# Altium project OpenRing_Debug.PrjPcb
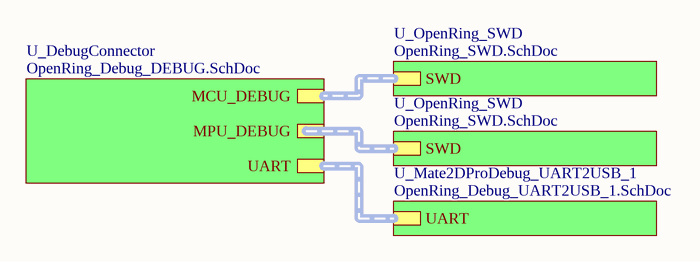
[diagram p0: OpenRing_Debug_Main.SchDoc]
4 sheets, 25 parts. Net scope: hierarchical (ports join the sheet entries above them; power ports are global).
Board file: OpenRing_Debug.PcbDoc
Sheets:
  OpenRing_Debug_Main.SchDoc
    U_DebugConnector = OpenRing_Debug_DEBUG.SchDoc
    U_Mate2DProDebug_UART2USB_1 = OpenRing_Debug_UART2USB_1.SchDoc
    U_OpenRing_SWD = OpenRing_SWD.SchDoc
    U_OpenRing_SWD = OpenRing_SWD.SchDoc

## Sheet OpenRing_Debug_Main.SchDoc
size A4; SheetNumber: 1; SheetTotal: 4; Size: A4

### Sub-sheets
U_DebugConnector = OpenRing_Debug_DEBUG.SchDoc: MCU_DEBUG (harness MCU_DEBUG), MPU_DEBUG (harness MPU_DEBUG), UART (harness UART)
U_Mate2DProDebug_UART2USB_1 = OpenRing_Debug_UART2USB_1.SchDoc: UART (harness UART)
U_OpenRing_SWD = OpenRing_SWD.SchDoc: SWD (harness SWD)
U_OpenRing_SWD = OpenRing_SWD.SchDoc: SWD (harness SWD)

### Buses and harness runs
harness sheet U_DebugConnector/MCU_DEBUG = sheet U_OpenRing_SWD/SWD
harness sheet U_DebugConnector/MPU_DEBUG = sheet U_OpenRing_SWD/SWD
harness sheet U_DebugConnector/UART = sheet U_Mate2DProDebug_UART2USB_1/UART

### Notes on the sheet
- Designer/Engineer
- Drawn By
- Document Name
- Board Title
- Sheet
- of
- Size
- Approved By
- Rev.
- Date

## Sheet OpenRing_Debug_DEBUG.SchDoc
size A4; SheetNumber: 2; SheetTotal: 4
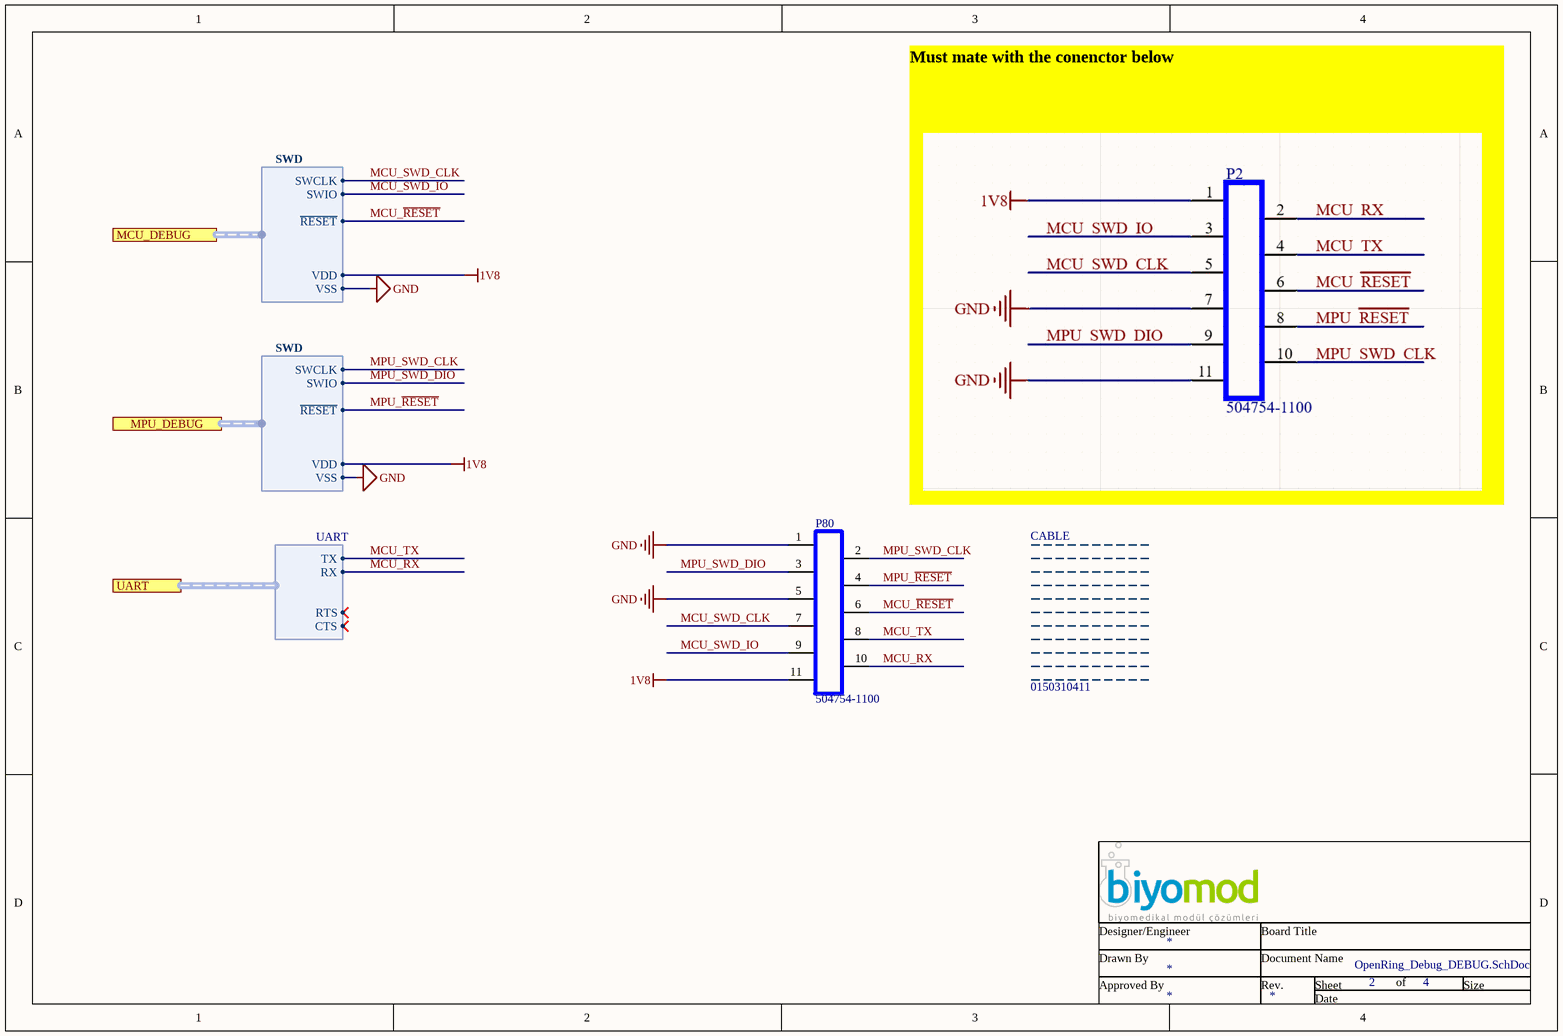
[diagram p1: OpenRing_Debug_DEBUG.SchDoc]

### Parts
CABLE  0150310411
P80  504754-1100  [5047541100]

### Ports
MCU_DEBUG (harness SWD), MPU_DEBUG (harness SWD), UART (harness UART)

### Harnesses
UART: TX, RX, RTS, CTS
SWD: SWCLK, SWIO, ~{RESET}, VDD, VSS

### Nets
1V8: P80.11 ; port MCU_DEBUG.VDD, port MPU_DEBUG.VDD
GND: P80.1 P80.5 ; port MCU_DEBUG.VSS, port MPU_DEBUG.VSS
MCU_~{RESET}: P80.6 ; port MCU_DEBUG.~{RESET}
MCU_RX: P80.10 ; port UART.RX
MCU_SWD_CLK: P80.7 ; port MCU_DEBUG.SWCLK
MCU_SWD_IO: P80.9 ; port MCU_DEBUG.SWIO
MCU_TX: P80.8 ; port UART.TX
MPU_~{RESET}: P80.4 ; port MPU_DEBUG.~{RESET}
MPU_SWD_CLK: P80.2 ; port MPU_DEBUG.SWCLK
MPU_SWD_DIO: P80.3 ; port MPU_DEBUG.SWIO

### Notes on the sheet
- Must mate with the conenctor below
- Designer/Engineer
- Drawn By
- Document Name
- Board Title
- Sheet
- of
- Size
- Approved By
- Rev.
- Date

### Library data of the parts
CABLE = 0150310411: 0.30mm Pitch Premo-Flex FPC Jumper with Notches, Same Side Contacts (Type A), 102.00mm Cable Length, Gold (Au) Plating, 11 Circuits; Manufacturer: Molex; Supplier: Mouser; Supplier Part Number: 538-15031-0411; Manufacturer Part Number: 0150310411; RoHS: No; Stock: 373; Pricing: 1=2.72, 10=2.23, 50=1.99, 100=1.89, 1000=1.69, 10000=1.69 (USD); Supplier 1: Mouser; Supplier Part Number 1: 538-15031-0411; Supplier 2: Farnell; Supplier Part Number 2: 4043858
P80 = 504754-1100: Conn FFC/FPC Connector SKT 11 POS 0.3mm Solder RA SMD Easy-On™ T/R; Manufacturer: Molex; CHECKED: FALSE; Supplier: Mouser; Supplier Part Number: 538-504754-1100; Manufacturer Part Number: 504754-1100; RoHS: No; Stock: 6459; Pricing: 1=0.77, 10=0.628, 50=0.544, 100=0.512, 1000=0.426, 10000=0.355 (USD); ComponentLink1URL: https://datasheet.octopart.com/504754-1100-Molex-datasheet-169278456.pdf?src-supplier=Farnell; ComponentLink1Description: https://datasheet.octopart.com/504754-1100-Molex-datasheet-169278456.pdf?src-supplier=Farnell; ComponentLink2URL: http://datasheet.octopart.com/5047541100-Molex-datasheet-38188796.pdf?src-supplier=Onlinecomponents.com; ComponentLink2Description: http://datasheet.octopart.com/5047541100-Molex-datasheet-38188796.pdf?src-supplier=Onlinecomponents.com; ComponentLink3URL: http://datasheet.octopart.com/5047541100-Molex-datasheet-38188796.pdf?src-supplier=Verical; ComponentLink3Description: http://datasheet.octopart.com/5047541100-Molex-datasheet-38188796.pdf?src-supplier=Verical; ComponentLink4URL: http://datasheet.octopart.com/5047541100-Molex-datasheet-38188796.pdf?src-supplier=Avnet; ComponentLink4Description: http://datasheet.octopart.com/5047541100-Molex-datasheet-38188796.pdf?src-supplier=Avnet; ComponentLink5URL: http://datasheet.octopart.com/5047541100-Molex-datasheet-38188796.pdf?src-supplier=TTI; ComponentLink5Description: http://datasheet.octopart.com/5047541100-Molex-datasheet-38188796.pdf?src-supplier=TTI; ComponentLink6URL: http://datasheet.octopart.com/5047541100-Molex-datasheet-38188796.pdf?src-supplier=Electro+Sonic; ComponentLink6Description: http://datasheet.octopart.com/5047541100-Molex-datasheet-38188796.pdf?src-supplier=Electro+Sonic; ComponentLink7URL: https://datasheet.octopart.com/504754-1100-Molex-datasheet-154754160.pdf?src-supplier=Master+Electronics; ComponentLink7Description: https://datasheet.octopart.com/504754-1100-Molex-datasheet-154754160.pdf?src-supplier=Master+Electronics; Supplier 1: Mouser; Supplier Part Number 1: 538-504754-1100; System: Connector

## Sheet OpenRing_Debug_UART2USB_1.SchDoc
size A4; SheetNumber: 4; SheetTotal: 4
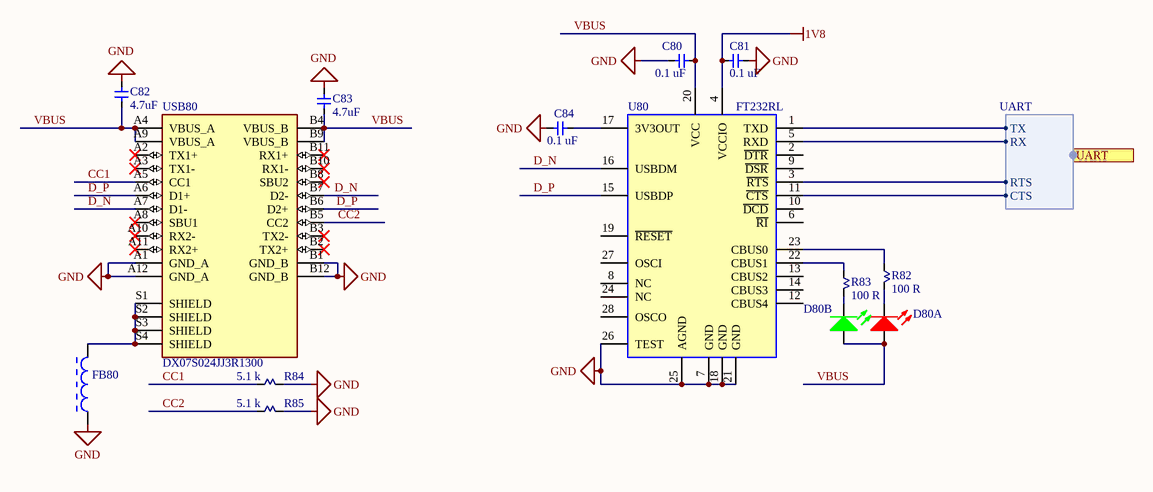
[diagram p2: OpenRing_Debug_UART2USB_1.SchDoc]

### Parts
C80  0.1 uF  [CAPC1005X05N]
C81  0.1 uF  [CAPC1005X05N]
C82  4.7uF  [CAPC1610X05N]
C83  4.7uF  [CAPC1610X05N]
C84  0.1 uF  [CAPC1005X05N]
D80  LTST-C155KGJRKT  [LTST-C155KGJRKT]  (value not drawn)  (parts A,B of 2)
FB80  BLM15AG601SN1D  [MURA-BLM15-CHIP-2_V]  (value not drawn)
R82  100 R  [RESC1005X04N]
R83  100 R  [RESC1005X04N]
R84  5.1 k  [RESC1005X04N]
R85  5.1 k  [RESC1005X04N]
U80  FT232RL  [SOP65P780X200-28N]
USB80  DX07S024JJ3R1300  [JAE-DX07S024JJ3R1300-MFG]

### Ports
UART (harness UART)

### Harnesses
UART: TX, RX, RTS, CTS

### Nets
1V8: C81.2 U80.4(VCCIO)
GND: C80.2 C81.1 C82.1 C83.1 C84.2 FB80.1 R84.2 R85.2 U80.7(GND) U80.18(GND) U80.21(GND) U80.25(AGND) U80.26(TEST) USB80.A1(GND_A) USB80.A12(GND_A) USB80.B1(GND_B) USB80.B12(GND_B)
CC1: R84.1 USB80.A5(CC1)  [project net CC1_4]
CC2: R85.1 USB80.B5(CC2)  [project net CC2_4]
D_N: U80.16(USBDM) USB80.A7(D1-) USB80.B7(D2-)  [project net D_N_4]
D_P: U80.15(USBDP) USB80.A6(D1+) USB80.B6(D2+)  [project net D_P_4]
MCU_RX: U80.5(RXD) ; port UART.RX
MCU_TX: U80.1(TXD) ; port UART.TX
VBUS: C80.1 C82.2 C83.2 D80.1(A) D80.2(A) U80.20(VCC) USB80.A4(VBUS_A) USB80.A9(VBUS_A) USB80.B4(VBUS_B) USB80.B9(VBUS_B)  [project net VBUS_4]
NetC84_1: C84.1 U80.17(3V3OUT)
NetD80_3: D80.3(K) R83.1
NetD80_4: D80.4(K) R82.1
NetFB80_2: FB80.2 USB80.S1(SHIELD) USB80.S2(SHIELD) USB80.S3(SHIELD) USB80.S4(SHIELD)
NetR82_2: R82.2 U80.23(CBUS0)
NetR83_2: R83.2 U80.22(CBUS1)
NetU80_3: U80.3(~{RTS}) ; port UART.RTS
NetU80_11: U80.11(~{CTS}) ; port UART.CTS

Not connected (* = marked no-connect by the designer): U80 2(~{DTR}) 6(~{RI}) 8(NC) 9(~{DSR}) 10(~{DCD}) 12(CBUS4) 13(CBUS2) 14(CBUS3) 19(~{RESET}) 24(NC) 27(OSCI) 28(OSCO); USB80 A2(TX1+)* A3(TX1-)* A8(SBU1)* A10(RX2-)* A11(RX2+)* B2(TX2+)* B3(TX2-)* B8(SBU2)* B10(RX1-)* B11(RX1+)*

### Notes on the sheet
- Designer/Engineer
- Drawn By
- Document Name
- Board Title
- Sheet
- of
- Size
- Approved By
- Rev.
- Date

### Library data of the parts
C80 C81 C84 = GRM155R61C104KA88D: CAP CER 0.1UF 16V X5R 0402; Manufacturer: Murata Electronics; Tolerance: 10 %; Type: Chip Multilayer Ceramic Capacitor for General Purpose; Voltage Rating DC: 16 VDC; Capacitance - nF: 100 nF; Capacitance - pF: 100000 pF; Supplier 1: Mouser; Manufacturer Part Number: GRM155R61C104KA88D; RoHS: RoHS Compliant; Category: Multilayer Ceramic Capacitors MLCC - SMD/SMT; Packaging: Cut Tape; Capacitance: 0.1 uF; Package / Case: 0402 (1005 metric); ComponentLink1URL: http://www.mouser.com/datasheet/2/281/murata_03052018_GRM_Series_1-1310166.pdf; ComponentLink1Description: http://www.mouser.com/datasheet/2/281/murata_03052018_GRM_Series_1-1310166.pdf; Supplier Part Number 1: 81-GRM155R61C104KA8D; Value: 0.1 uF; Stock: 0; Pricing: 1=0.082, 10=0.026, 100=0.011, 500=0.008, 1000=0.007, 2500=0.006, 5000=0.005, 10000=0.004 (EUR); Height: 0.5 mm; Length: 1 mm; Product: General Type MLCCs; Series: GRM; Termination Style: SMD/SMT; Width: 0.5 mm; Brand: Murata Electronics; Case Code - in: 0402; Case Code - mm: 1005; Dielectric: X5R; Maximum Operating Temperature: + 85 C; Minimum Operating Temperature: - 55 C; Standard Pack Qty: 10000; Termination: Standard; RoHS - Mouser: Y; Minimum Order Quantity: 1; Reeling: True; Supplier 2: Digikey; Supplier Part Number 2: 490-5415-1-ND; Supplier 3: Digikey; Supplier Part Number 3: 490-5415-6-ND
C82 C83 = CL10A475KP8NNNC: Cap Ceramic 4.7uF 10V X5R 10% Pad SMD 0603 85C T/R; Manufacturer: Samsung; Supplier 1: Digi-Key; Supplier Part Number 1: 1276-1044-1-ND; Manufacturer Part Number: CL10A475KP8NNNC; RoHS: Yes; Category: Ceramic Capacitors; Stock 1: 1008646; Pricing 1: 1=0.10000, 10=0.04800, 50=0.02620, 100=0.02140, 500=0.01528, 1000=0.01201 (USD); Mount: Surface Mount; Case/Package: 0603; Case Code (Imperial): 0603; Contact Plating: Tin; Case Code (Metric): 1608; Min Operating Temperature: -55°C; Max Operating Temperature: 85°C; Tolerance: 10%; Capacitance: 4.7uF; Dielectric: X5R; Package Quantity: 1; Packaging: Tape and Reel; Voltage Rating: 10V; Length: 1.6mm; Width: 0.031inch; Height: 0.8mm; Thickness: 0.035inch; Depth: 0.8mm; Radiation Hardening: No; ComponentLink1URL: https://datasheet.ciiva.com/25797/cl10a475kp8nnnc-25797520.pdf?src-supplier=Digi-Key; ComponentLink1Description: https://datasheet.ciiva.com/25797/cl10a475kp8nnnc-25797520.pdf?src-supplier=Digi-Key; ComponentLink2URL: https://datasheet.ciiva.com/26838/getdatasheetpartid-358676-26838384.pdf?src-supplier=Verical; ComponentLink2Description: https://datasheet.ciiva.com/26838/getdatasheetpartid-358676-26838384.pdf?src-supplier=Verical; ComponentLink3URL: https://datasheet.ciiva.com/16318/cl05b104kq5nnnc-16318245.pdf?src-supplier=Future+Electronics; ComponentLink3Description: https://datasheet.ciiva.com/16318/cl05b104kq5nnnc-16318245.pdf?src-supplier=Future+Electronics
D80 = LTST-C155KGJRKT: LED GREEN/RED CLEAR CHIP SMD; Manufacturer: Vishay Lite-On; Color: Green,Red; Lens Color: Colorless; Viewing Angle: 130°; Reverse Voltage: 5V; Wavelength: 639nm; Number of LEDs: 2; Forward Current: 30mA; Forward Voltage: 2V; Power Rating: 75mW; Luminous Intensity: 45mcd; Lens Style: Diffused,Colorless,Rectangular,Clear; Dominant Wavelength: 631nm; Test Current: 20mA; Supplier 1: Digi-Key; Manufacturer Part Number: LTST-C155KGJRKT; RoHS: Yes; Category: LEDs; Stock 1: 123598; Pricing 1: 1=0.43000, 10=0.28000, 100=0.18670, 500=0.12912, 1000=0.10760 (USD); Packaging: Tape and Reel; Lens Transparency: Clear; ComponentLink1URL: https://datasheet.ciiva.com/11774/0900766b80dc0273-11774195.pdf?src-supplier=RSComponents; ComponentLink1Description: https://datasheet.ciiva.com/11774/0900766b80dc0273-11774195.pdf?src-supplier=RSComponents; Supplier Part Number 1: 160-1409-1-ND; Mount: Surface Mount; Case/Package: 1210; Number of Pins: 4; Case Code (Imperial): 1210; Case Code (Metric): 3225; Min Operating Temperature: -55°C; Max Operating Temperature: 85°C; Package Quantity: 1; Illumination Color: Green,Red; Number of Elements: 2; Power Dissipation: 75mW; Max Power Dissipation: 75mW; Length: 2.7mm; Width: 2.7mm; Height: 1.1mm; Depth: 3.2mm; Radiation Hardening: No; Lead Free: Lead Free; ComponentLink2URL: https://datasheet.ciiva.com/15117/getdatasheetpartid-103641-15117440.pdf?src-supplier=Verical; ComponentLink2Description: https://datasheet.ciiva.com/15117/getdatasheetpartid-103641-15117440.pdf?src-supplier=Verical; ComponentLink3URL: https://datasheet.ciiva.com/16366/lite-on20ltst-c155kgjrkt-16366147.pdf?src-supplier=Future+Electronics; ComponentLink3Description: https://datasheet.ciiva.com/16366/lite-on20ltst-c155kgjrkt-16366147.pdf?src-supplier=Future+Electronics; ComponentLink4URL: https://datasheet.ciiva.com/27051/1260277-27051786.pdf?src-supplier=Jameco; ComponentLink4Description: https://datasheet.ciiva.com/27051/1260277-27051786.pdf?src-supplier=Jameco; ComponentLink5URL: https://datasheet.ciiva.com/2110/s-110-ltst-c155kgjrkt-2110800.pdf?src-supplier=Digi-Key; ComponentLink5Description: https://datasheet.ciiva.com/2110/s-110-ltst-c155kgjrkt-2110800.pdf?src-supplier=Digi-Key; ComponentLink6URL: https://datasheet.ciiva.com/2110/s-110-ltst-c155kgjrkt-2110801.pdf?src-supplier=Digi-Key; ComponentLink6Description: https://datasheet.ciiva.com/2110/s-110-ltst-c155kgjrkt-2110801.pdf?src-supplier=Digi-Key
FB80 = BLM15AG601SN1D: FERRITE BEAD 600 OHM 0402 1LN; Manufacturer: Murata; Material: Steel,Ferrite; Max DC Current: 300mA; DC Resistance (DCR): 520mR; Impedance: 600R; Test Frequency: 100MHz; Number of Lines: 1; Tolerance: 25%; Shielding: Unshielded; Supplier 1: Digi-Key; Supplier Part Number 1: 490-1006-1-ND; Manufacturer Part Number: BLM15AG601SN1D; RoHS: Yes; Category: Inductors; Stock 1: 436370; Pricing 1: 1=0.10000, 10=0.07600, 25=0.06960, 50=0.06260, 100=0.04590, 250=0.03336, 500=0.03058, 1000=0.02641, 5000=0.02085 (USD); Case/Package: 0402; Number of Pins: 2; Case Code (Metric): 1005; Case Code (Imperial): 0402; Core Material: Ferrite; Min Operating Temperature: -55°C; Max Operating Temperature: 125°C; Package Quantity: 10000; Packaging: Tape and Reel; Current Rating: 300mA; Termination: SMD/SMT; Max Current Rating: 300mA; Number of Circuits: 1; DC Current: 300mA; Frequency: 100MHz; Length: 1mm; Width: 0.5mm; Height: 0.5mm; Depth: 0.55mm; Radiation Hardening: No; REACH SVHC: No SVHC; Lead Free: Lead Free; Military Standard: Not; ComponentLink1URL: https://datasheet.ciiva.com/11799/0900766b811b5866-11799226.pdf?src-supplier=RSComponents; ComponentLink1Description: https://datasheet.ciiva.com/11799/0900766b811b5866-11799226.pdf?src-supplier=RSComponents; ComponentLink2URL: https://datasheet.ciiva.com/29347/442210-da-01-en-chip-drossel-0402-600r-300ma-1-0x0-5mm-29347879.pdf?src-supplier=Conrad; ComponentLink2Description: https://datasheet.ciiva.com/29347/442210-da-01-en-chip-drossel-0402-600r-300ma-1-0x0-5mm-29347879.pdf?src-supplier=Conrad; ComponentLink3URL: https://datasheet.ciiva.com/41449/001172163-da-01-en-drossel-0402-600r-1-0x0-5mm-10000st-41449450.pdf?src-supplier=Conrad; ComponentLink3Description: https://datasheet.ciiva.com/41449/001172163-da-01-en-drossel-0402-600r-1-0x0-5mm-10000st-41449450.pdf?src-supplier=Conrad; ComponentLink4URL: https://datasheet.ciiva.com/6212/l0110s0100blm15ag-sn-6212565.pdf?src-supplier=Digi-Key; ComponentLink4Description: https://datasheet.ciiva.com/6212/l0110s0100blm15ag-sn-6212565.pdf?src-supplier=Digi-Key; ComponentLink5URL: https://datasheet.ciiva.com/6212/l0110s0100blm15ag-sn-6212519.pdf?src-supplier=Digi-Key; ComponentLink5Description: https://datasheet.ciiva.com/6212/l0110s0100blm15ag-sn-6212519.pdf?src-supplier=Digi-Key; ComponentLink6URL: https://datasheet.ciiva.com/1466/5144-1466744.pdf?src-supplier=Element14; ComponentLink6Description: https://datasheet.ciiva.com/1466/5144-1466744.pdf?src-supplier=Element14; ComponentLink7URL: https://datasheet.ciiva.com/6212/l0110s0100blm15ag-sn-6212520.pdf?src-supplier=Digi-Key; ComponentLink7Description: https://datasheet.ciiva.com/6212/l0110s0100blm15ag-sn-6212520.pdf?src-supplier=Digi-Key; ComponentLink8URL: https://datasheet.ciiva.com/1466/5144-1466745.pdf?src-supplier=Element14; ComponentLink8Description: https://datasheet.ciiva.com/1466/5144-1466745.pdf?src-supplier=Element14; ComponentLink9URL: https://datasheet.ciiva.com/8510/l0110s0100blm15ag-sn-8510909.pdf?src-supplier=Avnet; ComponentLink9Description: https://datasheet.ciiva.com/8510/l0110s0100blm15ag-sn-8510909.pdf?src-supplier=Avnet; ComponentLink10URL: https://datasheet.ciiva.com/14122/blm-series-eng-tds-14122894.pdf?src-supplier=Distrelec; ComponentLink10Description: https://datasheet.ciiva.com/14122/blm-series-eng-tds-14122894.pdf?src-supplier=Distrelec; ComponentLink11URL: https://datasheet.ciiva.com/8084/l0110s0100blm15ag-sn-8084271.pdf?src-supplier=Avnet; ComponentLink11Description: https://datasheet.ciiva.com/8084/l0110s0100blm15ag-sn-8084271.pdf?src-supplier=Avnet
R82 R83 = ERJ-2RKF1000X: RES SMD 100 OHM 1% 1/10W 0402; Manufacturer: Panasonic Electronic Components; Resistance (Ohms): 100; Power (Watts): 0.1W, 1/10W; Temperature Coefficient: ±100ppm/°C; Supplier 1: Digi-Key; Manufacturer Part Number: ERJ-2RKF1000X; RoHS: RoHS Compliant; Category: Resistors; Stock 1: 1714577; Pricing 1: 1=0.1, 10=0.025, 25=0.018, 50=0.0136, 100=0.01, 250=0.00764, 500=0.00612, 1000=0.00451, 5000=0.00323 (USD); Packaging: Digi-Reel®; Part Status: Active; Tolerance: ±1%; Composition: Thick Film; Features: Automotive AEC-Q200; Operating Temperature: -55°C ~ 155°C; Package / Case: 0402 (1005 Metric); Supplier Device Package: 0402; Size / Dimension: 0.039" L x 0.020" W (1.00mm x 0.50mm); Height - Seated (Max): 0.016" (0.40mm); Number of Terminations: 2; Failure Rate: -; ComponentLink1URL: https://industrial.panasonic.com/cdbs/www-data/pdf/RDA0000/AOA0000C283.pdf; ComponentLink1Description: https://industrial.panasonic.com/cdbs/www-data/pdf/RDA0000/AOA0000C283.pdf; Supplier Part Number 1: P100LDKR-ND; Value: 100 R
R84 R85 = ERJ-2RKF5101X: RES SMD 5.1K OHM 1% 1/10W 0402; Manufacturer: Panasonic; Power Rating: 100mW; Voltage Rating: 50V; Temperature Coefficient: 100ppm/°C; Supplier: Mouser; Supplier Part Number: 667-ERJ-2RKF5101X; Manufacturer Part Number: ERJ-2RKF5101X; RoHS: Yes; Category: Chip SMD Resistors; Stock: 709989; Pricing: 1=0.1, 10=0.016, 50=0.016, 100=0.009, 1000=0.007, 10000=0.004 (USD); Mounting Technology: Surface Mount; Case/Package: 0402; Case Code (Imperial): 0402; Case Code (Metric): 1005; Weight: 2.8E-05oz; Contact Plating: Tin; Min Operating Temperature: -55°C; Max Operating Temperature: 155°C; Value: 5.1 k; Tolerance: 1%; Packaging: Tape and Reel; Package Quantity: 10000; Resistor Type: Thick Film; Termination: SMD/SMT; Number of Terminations: 2; Max Power Dissipation: 100mW; Series: ERJ; Resistance Tolerance: 1%; Technology: THICK FILM; Construction: Rectangular; Voltage Rating (DC): 50V; Length: 1mm; Width: 0.5mm; Height: 0.35mm; Depth: 0.5mm; Reach SVHC Compliant: No; Military Standard: Not; RoHS Compliant: Yes; Lead Free: 5697LeadFree; ComponentLink1URL: https://datasheet.ciiva.com/11821/0900766b80f80784-11821351.pdf?src-supplier=Rs; ComponentLink1Description: https://datasheet.ciiva.com/11821/0900766b80f80784-11821351.pdf?src-supplier=Rs; ComponentLink2URL: https://datasheet.ciiva.com/43467/1678782-43467375.pdf?src-supplier=Farnell; ComponentLink2Description: https://datasheet.ciiva.com/43467/1678782-43467375.pdf?src-supplier=Farnell; ComponentLink3URL: https://datasheet.ciiva.com/16761/70260748-16761739.pdf?src-supplier=Allied+Electronics; ComponentLink3Description: https://datasheet.ciiva.com/16761/70260748-16761739.pdf?src-supplier=Allied+Electronics; ComponentLink4URL: https://datasheet.ciiva.com/16788/70260748-16788554.pdf?src-supplier=Allied+Electronics; ComponentLink4Description: https://datasheet.ciiva.com/16788/70260748-16788554.pdf?src-supplier=Allied+Electronics; ComponentLink5URL: https://datasheet.ciiva.com/9195/aoa0000ce2-9195580.pdf?src-supplier=Avnet; ComponentLink5Description: https://datasheet.ciiva.com/9195/aoa0000ce2-9195580.pdf?src-supplier=Avnet; Supplier 1: Mouser; Supplier Part Number 1: 667-ERJ-2RKF5101X
U80 = FT232RL: IC USB FS SERIAL UART 28-SSOP; Manufacturer Part Number: FT232RL-REEL; Manufacturer: FTDI, Future Technology Devices International Ltd; Number of Channels: 1, UART; FIFO's: 256 Byte; Protocol: RS-232, RS-422, RS-485; Voltage - Supply: 3.3 V ~ 5.25 V; With Auto Flow Control: Yes; RoHS: RoHS Compliant; Category: Integrated Circuits (ICs); Stock 1: 34727; Pricing 1: 1=3.54, 10=3.185, 50=3.028, 100=2.8707, 250=2.55612, 500=2.24152 (EUR); Features: USB to UART; With Parallel Port: -; With IrDA Encoder/Decoder: -; With False Start Bit Detection: -; With Modem Control: Yes; With CMOS: Yes; Mounting Type: Surface Mount; Package / Case: 28-SSOP (0.209", 5.30mm Width); Supplier Device Package: 28-SSOP; Packaging: Digi-Reel®; ComponentLink1URL: http://www.ftdichip.com/Support/Documents/DataSheets/ICs/DS_FT232R.pdf; ComponentLink1Description: http://www.ftdichip.com/Support/Documents/DataSheets/ICs/DS_FT232R.pdf; Supplier 1: Digikey; Supplier Part Number 1: 768-1007-6-ND; Supplier 2: Farnell; Supplier Part Number 2: 1146032RL
USB80 = DX07S024JJ3R1300: Cut Tape - Usb Type C Receptacle Mid Mnt Dual R; Manufacturer: JAE Electronics; Number of Contacts: 24; Number of Ports: 1; Voltage Rating: 20V; Mating Cycles: 10000; Shielding: Shielded; Current Rating: 5A; Manufacturer Part Number: DX07S024JJ3R1300; RoHS: Yes; Category: USB Connectors; Stock: 21875; Pricing: 1=1.78, 10=1.612, 25=1.5272, 50=1.4916, 100=1.4205, 250=1.25048 (USD); Mounting Technology: Surface Mount,Through Hole,Horizontal; Contact Plating: Gold; Insulation Color: Black; Contact Material: 153,157ConductorMaterial; Min Operating Temperature: -30°C; Max Operating Temperature: 80°C; Packaging: Cut Tape; Connector Type: USB; Gender: Receptacle; Series: DX07; Termination: Solder; Height: 3.29mm; RoHS Compliant: Yes; ComponentLink1URL: http://www.alliedelec.com/m/d/e03b7b5d71e2d3e369c52d5c8eaca2b6.pdf?src-supplier=Allied+Electronics; ComponentLink1Description: http://www.alliedelec.com/m/d/e03b7b5d71e2d3e369c52d5c8eaca2b6.pdf?src-supplier=Allied+Electronics; ComponentLink2URL: http://www.jae.com/z-en/pdf_download_exec.cfm?param=SJ115995.pdf&src-supplier=Digikey; ComponentLink2Description: http://www.jae.com/z-en/pdf_download_exec.cfm?param=SJ115995.pdf&src-supplier=Digikey; Supplier 1: Mouser; Supplier Part Number 1: 656-DX07S024JJ3R1300; Supplier 2: Digikey; Supplier Part Number 2: 670-2846-1-ND

## Sheet OpenRing_SWD.SchDoc
size A4; SheetNumber: 3; SheetTotal: 4
Used 2 times, as channels U_OpenRing_SWD, U_OpenRing_SWD. Parts and nets are listed once, with the designators drawn on the sheet.
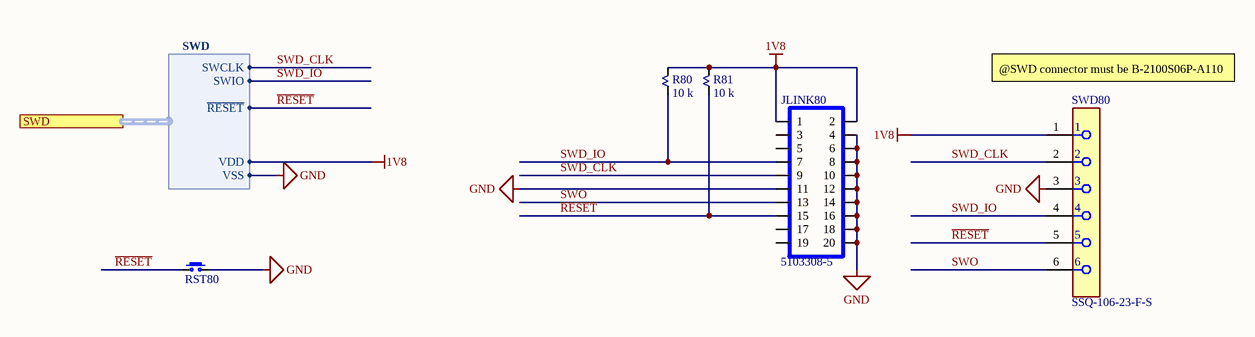
[diagram p3: OpenRing_SWD.SchDoc]

### Parts
JLINK80  5103308-5  [TE_5103308-5]
R80  10 k  [RESC1005X04N]
R81  10 k  [RESC1005X04N]
RST80  B3U-1000P  [B3U-1000P]  (value not drawn)
SWD80  SSQ-106-23-F-S  [FP-SSQ-106-23-F-S-MFG]

### Ports
SWD (harness SWD)

### Harnesses
SWD: SWCLK, SWIO, ~{RESET}, VDD, VSS

### Nets
1V8: JLINK80.1 JLINK80.2 R80.2 R81.2 SWD80.1 ; port SWD.VDD
GND: JLINK80.4 JLINK80.6 JLINK80.8 JLINK80.10 JLINK80.11 JLINK80.12 JLINK80.14 JLINK80.16 JLINK80.18 JLINK80.20 RST80.2 SWD80.3 ; port SWD.VSS
~{RESET}: JLINK80.15 R81.1 RST80.1 SWD80.5 ; port SWD.~{RESET}
SWD_CLK: JLINK80.9 SWD80.2 ; port SWD.SWCLK
SWD_IO: JLINK80.7 R80.1 SWD80.4 ; port SWD.SWIO
SWO: JLINK80.13 SWD80.6  [project net SWO_3]

Not connected (* = marked no-connect by the designer): JLINK80 3 5 17 19

### Channels
U_OpenRing_SWD: designators end in A
U_OpenRing_SWD: designators end in B

### Notes on the sheet
- @SWD connector must be B-2100S06P-A110 to be purchased from JLCPCB
- Designer/Engineer
- Drawn By
- Document Name
- Board Title
- Sheet
- of
- Size
- Approved By
- Rev.
- Date

### Library data of the parts
JLINK80 = 5103308-5: Header; Pin; Vertical; Copper Alloy; Thermoplastic; 20; 0.100 x 0.100 in.; 1 A; Manufacturer: AMP - TE CONNECTIVITY; Supplier 1: Digi-Key; Manufacturer Part Number: 5103308-5; RoHS: No; Category: Headers and Wire Housings; Stock 1: 6694; Pricing 1: 1=2.15000, 10=1.94800, 100=1.66990, 500=1.39158, 1000=1.19279, 5000=1.05760, 10000=1.03375 (USD); ComponentLink1URL: http://catalog.tycoelectronics.com/TE/bin/TE.Connect?C=1&M=BYPN&TCPN=5103308-5&RQPN=5103308-5&src-supplier=Farnell; ComponentLink1Description: http://catalog.tycoelectronics.com/TE/bin/TE.Connect?C=1&M=BYPN&TCPN=5103308-5&RQPN=5103308-5&src-supplier=Farnell; Supplier Part Number 1: A33165-ND; ComponentLink2URL: http://catalog.tycoelectronics.com/TE/bin/TE.Connect?C=1&M=BYPN&TCPN=5103308-5&RQPN=5103308-5&src-supplier=Newark; ComponentLink2Description: http://catalog.tycoelectronics.com/TE/bin/TE.Connect?C=1&M=BYPN&TCPN=5103308-5&RQPN=5103308-5&src-supplier=Newark; ComponentLink3URL: https://www.te.com/commerce/DocumentDelivery/DDEController?Action=srchrtrv&DocNm=5103308&DocType=Customer+Drawing&DocLang=English&src-supplier=Digi-Key; ComponentLink3Description: https://www.te.com/commerce/DocumentDelivery/DDEController?Action=srchrtrv&DocNm=5103308&DocType=Customer+Drawing&DocLang=English&src-supplier=Digi-Key
R80 R81 = ERJ-2RKF1002X: RES SMD 10K OHM 1% 1/10W 0402; Manufacturer: Panasonic Electronic Components; Power (Watts): 0.1W, 1/10W; Temperature Coefficient: ±100ppm/°C; Supplier 1: Digi-Key; Manufacturer Part Number: ERJ-2RKF1002X; RoHS: RoHS Compliant; Category: Resistors; Stock 1: 8105773; Pricing 1: 1=0.1, 10=0.025, 25=0.018, 50=0.0136, 100=0.01, 250=0.00764, 500=0.00612, 1000=0.00451, 5000=0.00323 (USD); Packaging: Digi-Reel®; Part Status: Active; Resistance (Ohms): 10k; Tolerance: ±1%; Composition: Thick Film; Features: Automotive AEC-Q200; Operating Temperature: -55°C ~ 155°C; Package / Case: 0402 (1005 Metric); Supplier Device Package: 0402; Size / Dimension: 0.039" L x 0.020" W (1.00mm x 0.50mm); Height - Seated (Max): 0.016" (0.40mm); Number of Terminations: 2; Failure Rate: -; ComponentLink1URL: https://industrial.panasonic.com/cdbs/www-data/pdf/RDA0000/AOA0000C283.pdf; ComponentLink1Description: https://industrial.panasonic.com/cdbs/www-data/pdf/RDA0000/AOA0000C283.pdf; Supplier Part Number 1: P10.0KLDKR-ND; Value: 10 k
RST80 = B3U-1000P: SWITCH TACTILE SPST-NO 0.05A 12V; Manufacturer: Omron Electronics Inc-EMC Div; Switch Function: Off-Mom; Contact Rating @ Voltage: 0.05A @ 12VDC; Actuator Type: Standard; Actuator Height off PCB, from Pins: 1.60mm; Actuator Orientation: Top Actuated; Outline: 3.00mm x 2.50mm; Illumination: Non-Illuminated; Operating Force: 153gf; Ingress Protection: Dust Proof; Switch Travel: 0.15mm; Mechanical Life: 200,000 Cycles; Supplier 1: Digi-Key; Manufacturer Part Number: B3U-1000P; RoHS: RoHS Compliant; Category: Switches; Stock 1: 66079; Pricing 1: 1=0.93, 10=0.898, 25=0.8468, 50=0.745, 100=0.6774, 250=0.64348, 500=0.62656, 1000=0.49108 (GBP); Packaging: Digi-Reel®; Part Status: Active; Circuit: SPST-NO; Mounting Type: Surface Mount; Termination Style: SMD (SMT) Tab; Illumination Voltage (Nominal): -; Illumination Type, Color: -; Features: -; Actuator Material: -; Operating Temperature: -25°C ~ 70°C; ComponentLink1URL: http://www.omron.com/ecb/products/pdf/en-b3u.pdf; ComponentLink1Description: http://www.omron.com/ecb/products/pdf/en-b3u.pdf; Supplier Part Number 1: SW1020DKR-ND
SWD80 = SSQ-106-23-F-S: Headers & Wire Housings Tiger Buy Socket Strip with Square Tails, 0.100 Pitch; Manufacturer: Samtec; Gender: Receptacle; Number of Contacts: 6; Pitch: 2.54mm; Supplier: Digikey; Supplier Part Number: SSQ-106-23-F-S-ND; Manufacturer Part Number: SSQ-106-23-F-S; RoHS: Yes; Category: Headers and Wire Housings; Stock: 84; Pricing: 1=1.54, 50=1.2, 100=0.97, 500=0.82, 1000=0.775 (USD); Mounting Technology: Through Hole; Contact Plating: Gold; Contact Material: Bronze; Packaging: Bulk; Number of Rows: 1; Termination: Solder; Series: SSQ; Radiation Hardening: No; Lead Free: Lead Free; RoHS Compliant: Yes; Reach SVHC Compliant: No; ComponentLink1URL: ftp://ftp.samtec.com/webfiles/PDF/SSQ_TH.PDF?src-supplier=Avnet; ComponentLink1Description: ftp://ftp.samtec.com/webfiles/PDF/SSQ_TH.PDF?src-supplier=Avnet; Supplier 1: Digikey; Supplier Part Number 1: SSQ-106-23-F-S-ND

## Nets that join several sheets
1V8: OpenRing_Debug_DEBUG (P80.11), OpenRing_Debug_UART2USB_1 (C81.2 U80.4), U_OpenRing_SWD (5 pins), U_OpenRing_SWD (5 pins)
GND: OpenRing_Debug_DEBUG (P80.1 P80.5), OpenRing_Debug_UART2USB_1 (17 pins), U_OpenRing_SWD (12 pins), U_OpenRing_SWD (12 pins)
MCU_~{RESET}: OpenRing_Debug_DEBUG (P80.6), U_OpenRing_SWD (JLINK80B.15 R81B.1 RST80B.1 SWD80B.5)
MCU_RX: OpenRing_Debug_DEBUG (P80.10), OpenRing_Debug_UART2USB_1 (U80.5)
MCU_SWD_CLK: OpenRing_Debug_DEBUG (P80.7), U_OpenRing_SWD (JLINK80B.9 SWD80B.2)
MCU_SWD_IO: OpenRing_Debug_DEBUG (P80.9), U_OpenRing_SWD (JLINK80B.7 R80B.1 SWD80B.4)
MCU_TX: OpenRing_Debug_DEBUG (P80.8), OpenRing_Debug_UART2USB_1 (U80.1)
MPU_~{RESET}: OpenRing_Debug_DEBUG (P80.4), U_OpenRing_SWD (JLINK80A.15 R81A.1 RST80A.1 SWD80A.5)
MPU_SWD_CLK: OpenRing_Debug_DEBUG (P80.2), U_OpenRing_SWD (JLINK80A.9 SWD80A.2)
MPU_SWD_DIO: OpenRing_Debug_DEBUG (P80.3), U_OpenRing_SWD (JLINK80A.7 R80A.1 SWD80A.4)